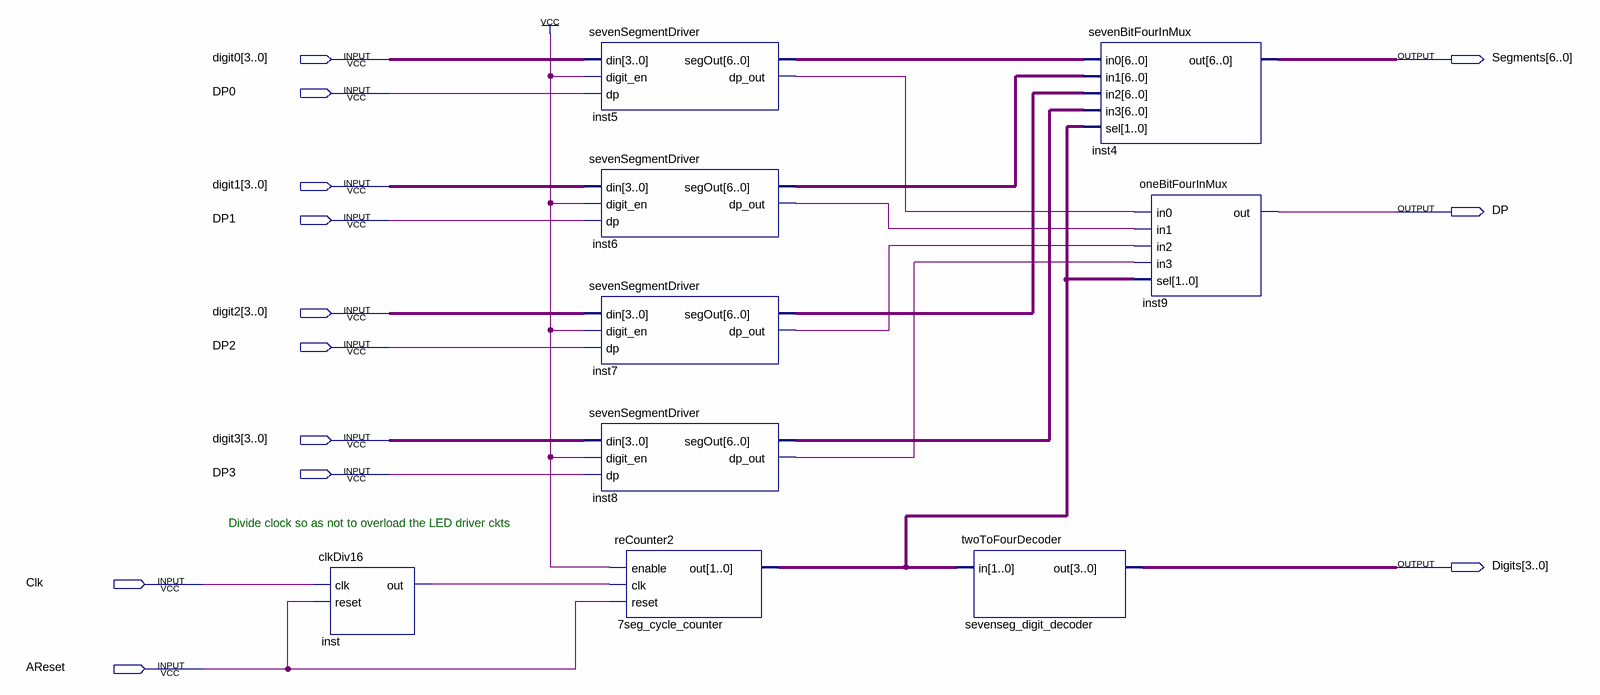
[diagram p0: schematic sheet]
// Quartus schematic Quad7segDriver.bdf as structural Verilog: 9 symbols, 13 pins
module Quad7segDriver (
  input  [3:0] digit0,
  input  DP0,
  input  [3:0] digit1,
  input  DP1,
  input  [3:0] digit2,
  input  DP2,
  input  [3:0] digit3,
  input  DP3,
  input  Clk,
  input  AReset,
  output [6:0] Segments,
  output DP,
  output [3:0] Digits
);

  wire inst5_dp_out, inst6_dp_out, inst7_dp_out, inst8_dp_out, inst_out;
  wire [1:0] n7seg_cycle_counter_out;
  wire [6:0] inst5_segout, inst6_segout, inst7_segout, inst8_segout;

  clkDiv16 inst (.clk(Clk), .reset(AReset), .out(inst_out));
  sevenSegmentDriver inst5 (.din(digit0), .digit_en(1'b1), .dp(DP0), .segOut(inst5_segout), .dp_out(inst5_dp_out));
  sevenSegmentDriver inst6 (.din(digit1), .digit_en(1'b1), .dp(DP1), .segOut(inst6_segout), .dp_out(inst6_dp_out));
  sevenSegmentDriver inst7 (.din(digit2), .digit_en(1'b1), .dp(DP2), .segOut(inst7_segout), .dp_out(inst7_dp_out));
  sevenSegmentDriver inst8 (.din(digit3), .digit_en(1'b1), .dp(DP3), .segOut(inst8_segout), .dp_out(inst8_dp_out));
  reCounter2 u_7seg_cycle_counter (.enable(1'b1), .clk(inst_out), .reset(AReset), .out(n7seg_cycle_counter_out));
  twoToFourDecoder sevenseg_digit_decoder (.in(n7seg_cycle_counter_out), .out(Digits));
  sevenBitFourInMux inst4 (
    .in0(inst5_segout), .in1(inst6_segout), .in2(inst7_segout), .in3(inst8_segout),
    .sel(n7seg_cycle_counter_out), .out(Segments));
  oneBitFourInMux inst9 (
    .in0(inst5_dp_out), .in1(inst6_dp_out), .in2(inst7_dp_out), .in3(inst8_dp_out),
    .sel(n7seg_cycle_counter_out), .out(DP));

  // Notes on the sheet:
  //   Divide clock so as not to overload the LED driver ckts
endmodule
